# EAGLE schematic TL-WR703N (EAGLE 6.1)
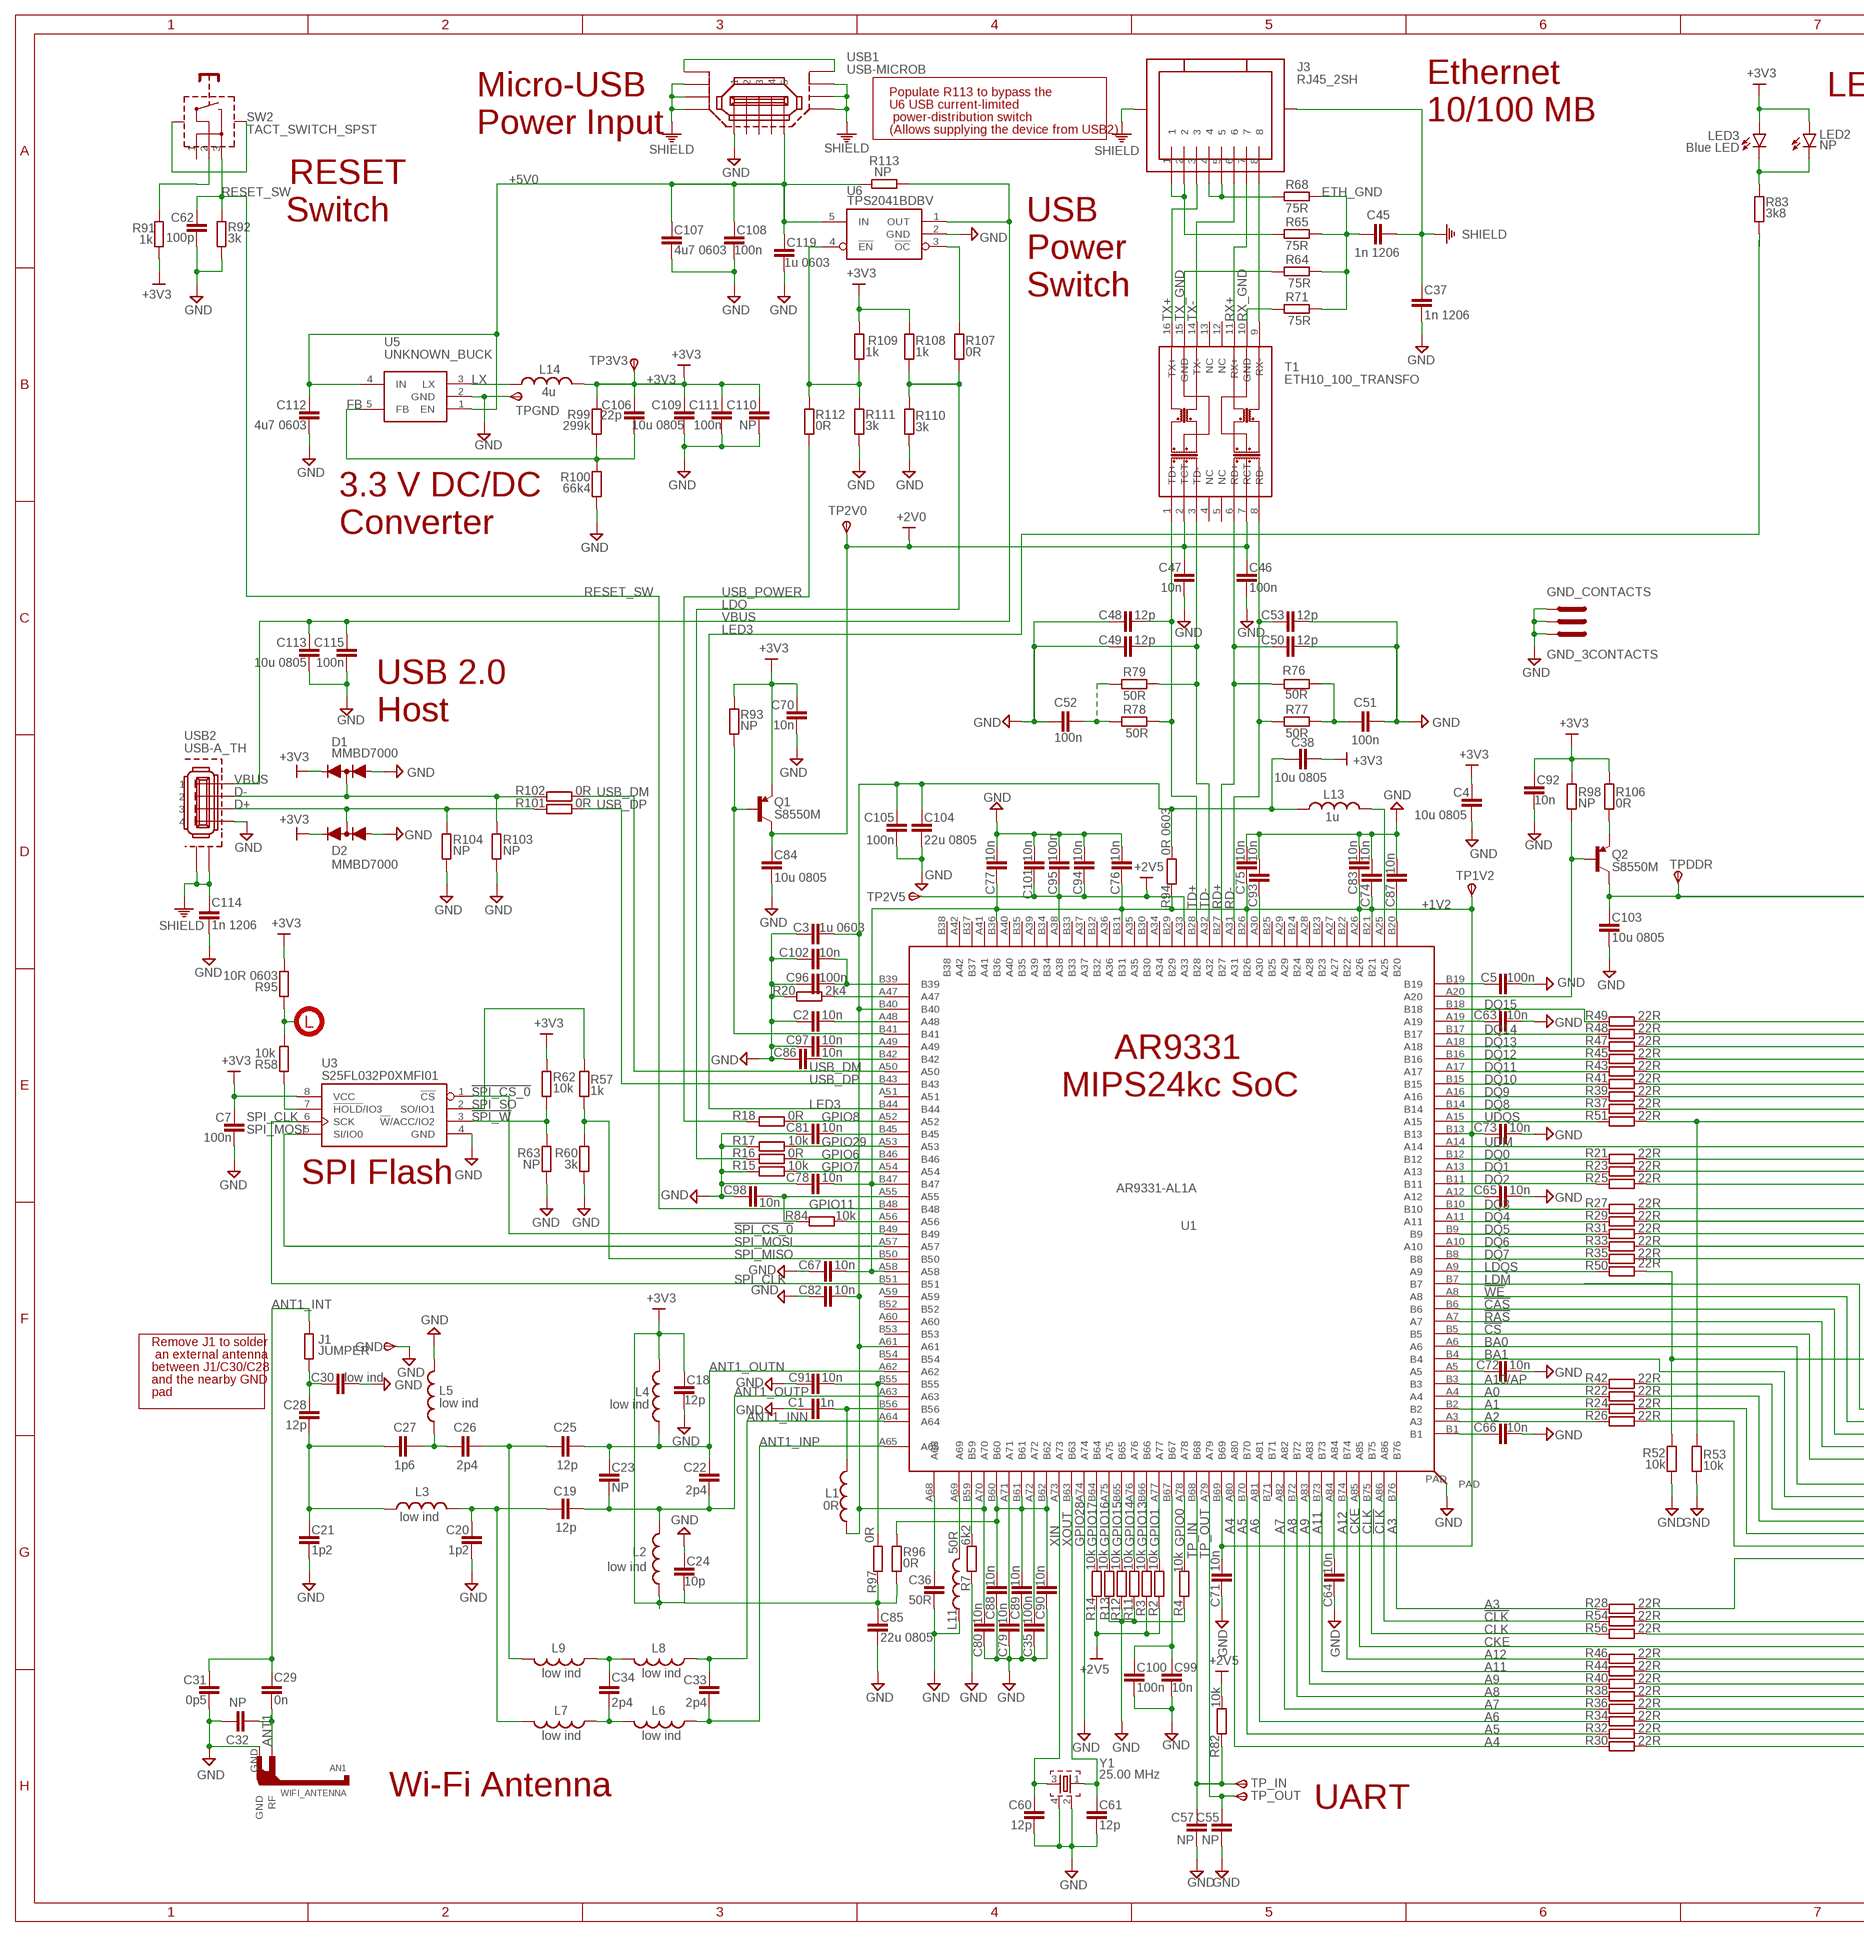
[diagram p0: schematic, sheet 1, part 1 of 2]
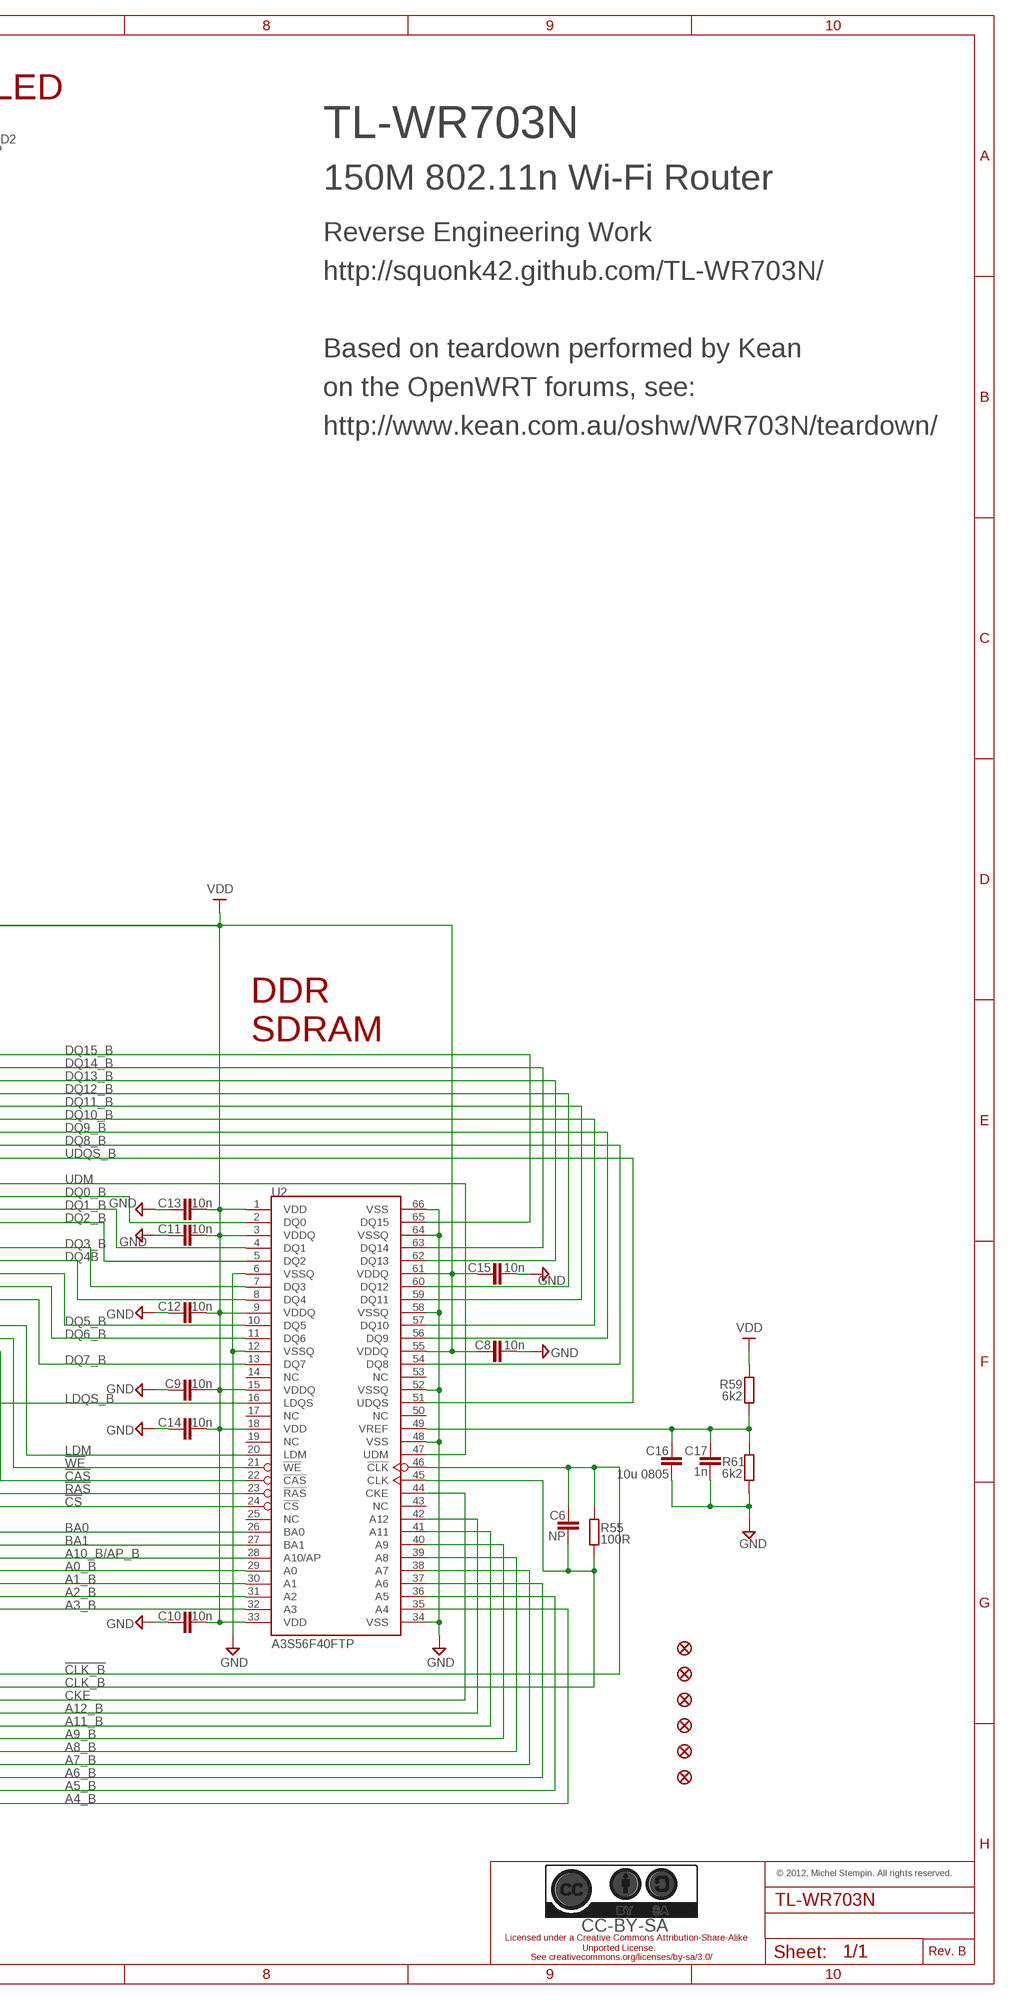
[diagram p1: schematic, sheet 1, part 2 of 2]

## Parts
AN1  WIFI_ANTENNA  [WIFI_ANTENNA]
C1  1n  CAP_0402  [C0402]
C2  10n  CAP_0402  [C0402]
C3  1u 0603  CAP_0603  [C0603]
C4  10u 0805  CAP_0805  [C0805]
C5  100n  CAP_0402  [C0402]
C6  NP  CAP_0402  [C0402]
C7  100n  CAP_0402  [C0402]
C8  10n  CAP_0402  [C0402]
C9  10n  CAP_0402  [C0402]
C10  10n  CAP_0402  [C0402]
C11  10n  CAP_0402  [C0402]
C12  10n  CAP_0402  [C0402]
C13  10n  CAP_0402  [C0402]
C14  10n  CAP_0402  [C0402]
C15  10n  CAP_0402  [C0402]
C16  10u 0805  CAP_0805  [C0805]
C17  1n  CAP_0402  [C0402]
C18  12p  CAP_0402  [C0402]
C19  12p  CAP_0402  [C0402]
C20  1p2  CAP_0402  [C0402]
C21  1p2  CAP_0402  [C0402]
C22  2p4  CAP_0402  [C0402]
C23  NP  CAP_0402  [C0402]
C24  10p  CAP_0402  [C0402]
C25  12p  CAP_0402  [C0402]
C26  2p4  CAP_0402  [C0402]
C27  1p6  CAP_0402  [C0402]
C28  12p  CAP_0402  [C0402]
C29  0n  CAP_0402  [C0402]
C30  low ind  CAP_0402  [C0402]
C31  0p5  CAP_0402  [C0402]
C32  NP  CAP_0402  [C0402]
C33  2p4  CAP_0402  [C0402]
C34  2p4  CAP_0402  [C0402]
C35  100n  CAP_0402  [C0402]
C36  50R  CAP_0402  [C0402]
C37  1n 1206  CAP_1206  [C1206]
C38  10u 0805  CAP_0805  [C0805]
C45  1n 1206  CAP_1206  [C1206]
C46  100n  CAP_0402  [C0402]
C47  10n  CAP_0402  [C0402]
C48  12p  CAP_0402  [C0402]
C49  12p  CAP_0402  [C0402]
C50  12p  CAP_0402  [C0402]
C51  100n  CAP_0402  [C0402]
C52  100n  CAP_0402  [C0402]
C53  12p  CAP_0402  [C0402]
C55  NP  CAP_0402  [C0402]
C57  NP  CAP_0402  [C0402]
C60  12p  CAP_0402  [C0402]
C61  12p  CAP_0402  [C0402]
C62  100p  CAP_0402  [C0402]
C63  10n  CAP_0402  [C0402]
C64  10n  CAP_0402  [C0402]
C65  10n  CAP_0402  [C0402]
C66  10n  CAP_0402  [C0402]
C67  10n  CAP_0402  [C0402]
C70  10n  CAP_0402  [C0402]
C71  10n  CAP_0402  [C0402]
C72  10n  CAP_0402  [C0402]
C73  10n  CAP_0402  [C0402]
C74  10n  CAP_0402  [C0402]
C75  10n  CAP_0402  [C0402]
C76  10n  CAP_0402  [C0402]
C77  10n  CAP_0402  [C0402]
C78  10n  CAP_0402  [C0402]
C79  10n  CAP_0402  [C0402]
C80  10n  CAP_0402  [C0402]
C81  10n  CAP_0402  [C0402]
C82  10n  CAP_0402  [C0402]
C83  10n  CAP_0402  [C0402]
C84  10u 0805  CAP_0805  [C0805]
C85  22u 0805  CAP_0805  [C0805]
C86  10n  CAP_0402  [C0402]
C87  10n  CAP_0402  [C0402]
C88  10n  CAP_0402  [C0402]
C89  10n  CAP_0402  [C0402]
C90  10n  CAP_0402  [C0402]
C91  10n  CAP_0402  [C0402]
C92  10n  CAP_0402  [C0402]
C93  10n  CAP_0402  [C0402]
C94  10n  CAP_0402  [C0402]
C95  100n  CAP_0402  [C0402]
C96  100n  CAP_0402  [C0402]
C97  10n  CAP_0402  [C0402]
C98  10n  CAP_0402  [C0402]
C99  10n  CAP_0402  [C0402]
C100  100n  CAP_0402  [C0402]
C101  10n  CAP_0402  [C0402]
C102  10n  CAP_0402  [C0402]
C103  10u 0805  CAP_0805  [C0805]
C104  22u 0805  CAP_0805  [C0805]
C105  100n  CAP_0402  [C0402]
C106  22p  CAP_0402  [C0402]
C107  4u7 0603  CAP_0603  [C0603]
C108  100n  CAP_0402  [C0402]
C109  10u 0805  CAP_0805  [C0805]
C110  NP  CAP_0603  [C0603]
C111  100n  CAP_0402  [C0402]
C112  4u7 0603  CAP_0603  [C0603]
C113  10u 0805  CAP_0805  [C0805]
C114  1n 1206  CAP_1206  [C1206]
C115  100n  CAP_0402  [C0402]
C119  1u 0603  CAP_0603  [C0603]
D1  MMBD7000  [SOT23-3]
D2  MMBD7000  [SOT23-3]
E$1  FIDUCIAL  [FIDUCIAL]
E$2  FIDUCIAL  [FIDUCIAL]
E$3  FIDUCIAL  [FIDUCIAL]
E$4  FIDUCIAL  [FIDUCIAL]
E$5  FIDUCIAL  [FIDUCIAL]
E$6  FIDUCIAL  [FIDUCIAL]
E$7  CC-BY-SA  [CC-BY-SA]
GND  TEST_PAD_SHIELD  [SHIELD_PAD]
GND_CONTACTS  GND_3CONTACTS  [GND_3CONTACT]
J1  JUMPER  [J0603]
J3  RJ45_2SH  [RJ45_LP_RA_SMT]
L1  0R  IND_0402  [L0402]
L2  low ind  IND_0402  [L0402]
L3  low ind  IND_0402  [L0402]
L4  low ind  IND_0402  [L0402]
L5  low ind  IND_0402  [L0402]
L6  low ind  IND_0402  [L0402]
L7  low ind  IND_0402  [L0402]
L8  low ind  IND_0402  [L0402]
L9  low ind  IND_0402  [L0402]
L11  50R  IND_0402  [L0402]
L13  1u  IND_1008  [L1008]
L14  4u  IND_SELF  [FERRITE_SELF]
LED2  NP  LED_3MM  [LED3MM]
LED3  Blue LED  LED_0603  [LED0603]
Q1  S8550M  TRANSISTOR_PNP  [SOT23-3]
Q2  S8550M  TRANSISTOR_PNP  [SOT23-3]
R2  10k  RES_0402  [R0402]
R3  10k  RES_0402  [R0402]
R4  10k  RES_0402  [R0402]
R7  6k2  RES_0402  [R0402]
R11  10k  RES_0402  [R0402]
R12  10k  RES_0402  [R0402]
R13  10k  RES_0402  [R0402]
R14  10k  RES_0402  [R0402]
R15  10k  RES_0402  [R0402]
R16  0R  RES_0402  [R0402]
R17  10k  RES_0402  [R0402]
R18  0R  RES_0402  [R0402]
R20  2k4  RES_0402  [R0402]
R21  22R  RES_0402  [R0402]
R22  22R  RES_0402  [R0402]
R23  22R  RES_0402  [R0402]
R24  22R  RES_0402  [R0402]
R25  22R  RES_0402  [R0402]
R26  22R  RES_0402  [R0402]
R27  22R  RES_0402  [R0402]
R28  22R  RES_0402  [R0402]
R29  22R  RES_0402  [R0402]
R30  22R  RES_0402  [R0402]
R31  22R  RES_0402  [R0402]
R32  22R  RES_0402  [R0402]
R33  22R  RES_0402  [R0402]
R34  22R  RES_0402  [R0402]
R35  22R  RES_0402  [R0402]
R36  22R  RES_0402  [R0402]
R37  22R  RES_0402  [R0402]
R38  22R  RES_0402  [R0402]
R39  22R  RES_0402  [R0402]
R40  22R  RES_0402  [R0402]
R41  22R  RES_0402  [R0402]
R42  22R  RES_0402  [R0402]
R43  22R  RES_0402  [R0402]
R44  22R  RES_0402  [R0402]
R45  22R  RES_0402  [R0402]
R46  22R  RES_0402  [R0402]
R47  22R  RES_0402  [R0402]
R48  22R  RES_0402  [R0402]
R49  22R  RES_0402  [R0402]
R50  22R  RES_0402  [R0402]
R51  22R  RES_0402  [R0402]
R52  10k  RES_0402  [R0402]
R53  10k  RES_0402  [R0402]
R54  22R  RES_0402  [R0402]
R55  100R  RES_0402  [R0402]
R56  22R  RES_0402  [R0402]
R57  1k  RES_0402  [R0402]
R58  10k  RES_0402  [R0402]
R59  6k2  RES_0402  [R0402]
R60  3k  RES_0402  [R0402]
R61  6k2  RES_0402  [R0402]
R62  10k  RES_0402  [R0402]
R63  NP  RES_0402  [R0402]
R64  75R  RES_0402  [R0402]
R65  75R  RES_0402  [R0402]
R68  75R  RES_0402  [R0402]
R71  75R  RES_0402  [R0402]
R76  50R  RES_0402  [R0402]
R77  50R  RES_0402  [R0402]
R78  50R  RES_0402  [R0402]
R79  50R  RES_0402  [R0402]
R82  10k  RES_0402  [R0402]
R83  3k8  RES_0402  [R0402]
R84  10k  RES_0402  [R0402]
R91  1k  RES_0402  [R0402]
R92  3k  RES_0402  [R0402]
R93  NP  RES_0402  [R0402]
R94  0R 0603  RES_0603  [R0603]
R95  10R 0603  RES_0603  [R0603]
R96  0R  RES_0402  [R0402]
R97  0R  RES_0402  [R0402]
R98  NP  RES_0402  [R0402]
R99  299k  RES_0402  [R0402]
R100  66k4  RES_0402  [R0402]
R101  0R  RES_0402  [R0402]
R102  0R  RES_0402  [R0402]
R103  NP  RES_0402  [R0402]
R104  NP  RES_0402  [R0402]
R106  0R  RES_0402  [R0402]
R107  0R  RES_0402  [R0402]
R108  1k  RES_0402  [R0402]
R109  1k  RES_0402  [R0402]
R110  3k  RES_0402  [R0402]
R111  3k  RES_0402  [R0402]
R112  0R  RES_0402  [R0402]
R113  NP  RES_0805  [R0805]
SW2  TACT_SWITCH_SPST  [TACT_SWITCH_SPST_RA_SMT]
T1  ETH10_100_TRANSFO  [H1601CG]
TP1V2  TEST_PAD  [TEST_PAD]
TP2V0  TEST_PAD  [TEST_PAD]
TP2V5  TEST_PAD  [TEST_PAD]
TP3V3  TEST_PAD  [TEST_PAD]
TP_IN  TEST_PAD  [TEST_PAD]
TP_OUT  TEST_PAD  [TEST_PAD]
TPDDR  TEST_PAD  [TEST_PAD]
TPGND  TEST_PAD  [TEST_PAD]
U1  AR9331-AL1A  [DRMLF164]
U2  A3S56F40FTP  [TSOP66]
U3  S25FL032P0XMFI01  [SOP8]
U5  UNKNOWN_BUCK  [SOT23-5]
U6  TPS2041BDBV  [SOT23-5]
USB1  USB-MICROB  [USB-MICROB]
USB2  USB-A_TH  [USB-A_TH]
Y1  25.00 MHz  CRYSTAL_2SHIELD  [CRYSTAL_32_25]

## Nets
!CAS: U1.B6 U2.22(!CAS)
!CLK: R54.1 U1.A86
!CLK_B: C6.2 R54.2 R55.2 U2.46(!CLK)
!CS: U1.B5 U2.24(!CS)
!RAS: U1.A7 U2.23(!RAS)
!SPI_CS_0: U1.B49 U3.1(!CS)
!SPI_W: R62.2 R63.1 U3.3(!W!/ACC/IO2)
!WE: U1.A8 U2.21(!WE)
$28: C52.2 R78.1 R79.2
+1V2 [Power]: C67.2 C71.2 C73.1 C74.2 C75.1 C76.1 C77.2 C78.2 C83.1 R94.2 TP1V2.1(PP) U1.A26 U1.A58 U1.B13 U1.B21 U1.B26 U1.B31 U1.B36 U1.B47 U1.B69
+2V0 [Power]: C46.1 C47.1 C84.2 Q1.3(C) T1.2(TCT) T1.7(RCT) TP2V0.1(PP)
+2V5 [Power]: C94.2 C95.2 C101.2 R2.1 R3.1 R14.2 R82.1 TP2V5.1(PP) U1.A33 U1.A38
+3V3: C4.2 C7.1 C18.1 C24.1 C38.2 C70.2 C85.2 C92.2 C106.2 C109.2 C110.1 C111.1 D1.2(C) D2.2(C) L2.1 L4.2 L14.1 LED2.A LED3.A Q1.2(E) R62.1 R91.1 R93.2 R95.1 R96.2 R97.2 R98.2 R99.2 R106.2 R108.2 R109.1 TP3V3.1(PP) U3.8(VCC)
+5V0 [Power]: C107.2 C108.2 C112.1 C119.1 R113.1 U5.1(EN) U5.4(IN) U6.5(IN) USB1.VBUS
A0: R22.1 U1.A4
A0_B: R22.2 U2.29(A0)
A1: R24.1 U1.B2
A1_B: R24.2 U2.30(A1)
A2: R26.1 U1.A3
A2_B: R26.2 U2.31(A2)
A3: R28.1 U1.B76
A3_B: R28.2 U2.32(A3)
A4: R30.1 U1.A80
A4_B: R30.2 U2.35(A4)
A5: R32.1 U1.B70
A5_B: R32.2 U2.36(A5)
A6: R34.1 U1.A81
A6_B: R34.2 U2.37(A6)
A7: R36.1 U1.A82
A7_B: R36.2 U2.38(A7)
A8: R38.1 U1.B72
A8_B: R38.2 U2.39(A8)
A9: R40.1 U1.A83
A9_B: R40.2 U2.40(A9)
A10/AP: R42.1 U1.B3
A10_B/AP_B: R42.2 U2.28(A10/AP)
A11: R44.1 U1.B73
A11_B: R44.2 U2.41(A11)
A12: R46.1 U1.B74
A12_B: R46.2 U2.42(A12)
ANT1 [RF]: AN1.RF C29.2 C32.2
ANT1_INN [RF]: C33.2 L8.1 U1.A64
ANT1_INP [RF]: C33.1 L6.1 U1.A65
ANT1_INT [RF]: C29.1 C31.1 J1.2
ANT1_OUTN [RF]: C22.2 C23.2 C25.2 L4.1 U1.A62
ANT1_OUTP [RF]: C19.2 C22.1 C23.1 L2.2 U1.A63
BA0: U1.A6 U2.26(BA0)
BA1: U1.B4 U2.27(BA1)
CKE: U1.A85 U2.44(CKE)
CLK: R56.1 U1.B75
CLK_B: C6.1 R55.1 R56.2 U2.45(CLK)
D+: D2.3(M) R101.1 R104.1 USB2.3
D-: D1.3(M) R102.1 R103.1 USB2.2
DQ0: R21.2 U1.B12
DQ0_B: R21.1 U2.2(DQ0)
DQ1: R23.2 U1.A13
DQ1_B: R23.1 U2.4(DQ1)
DQ2: R25.2 U1.B11
DQ2_B: R25.1 U2.5(DQ2)
DQ3: R27.2 U1.B10
DQ3_B: R27.1 U2.7(DQ3)
DQ4: R29.2 U1.A11
DQ4B: R29.1 U2.8(DQ4)
DQ5: R31.2 U1.B9
DQ5_B: R31.1 U2.10(DQ5)
DQ6: R33.2 U1.A10
DQ6_B: R33.1 U2.11(DQ6)
DQ7: R35.2 U1.B8
DQ7_B: R35.1 U2.13(DQ7)
DQ8: R37.1 U1.B14
DQ8_B: R37.2 U2.54(DQ8)
DQ9: R39.1 U1.A16
DQ9_B: R39.2 U2.56(DQ9)
DQ10: R41.1 U1.B15
DQ10_B: R41.2 U2.57(DQ10)
DQ11: R43.1 U1.A17
DQ11_B: R43.2 U2.59(DQ11)
DQ12: R45.1 U1.B16
DQ12_B: R45.2 U2.60(DQ12)
DQ13: R47.1 U1.A18
DQ13_B: R47.2 U2.62(DQ13)
DQ14: R48.1 U1.B17
DQ14_B: R48.2 U2.63(DQ14)
DQ15: R49.1 U1.B18
DQ15_B: R49.2 U2.65(DQ15)
ETH_GND [RF]: C45.2 R64.1 R65.2 R68.2 R71.1
FB: C106.1 R99.1 R100.2 U5.5(FB)
GND: AN1.GND C1.2 C2.2 C3.2 C4.1 C5.2 C7.2 C8.2 C9.1 C10.1 C11.1 C12.1 C13.1 C14.1 C15.2 C16.1 C17.1 C18.2 C20.1 C21.1 C24.2 C30.2 C31.2 C32.1 C35.1 C36.1 C37.1 C46.2 C47.2 C48.1 C49.2 C50.1 C51.1 C52.1 C53.2 C55.2 C57.1 C60.1 C61.2 C62.1 C63.1 C64.1 C65.2 C66.1 C67.1 C70.1 C71.1 C72.1 C73.2 C74.1 C75.2 C76.2 C77.1 C78.1 C79.2 C80.2 C81.1 C82.1 C83.2 C84.1 C85.1 C86.1 C87.2 C88.2 C89.2 C90.2 C91.1 C92.1 C93.1 C94.1 C95.1 C96.1 C97.2 C98.2 C99.1 C100.1 C101.1 C102.1 C103.2 C104.2 C105.2 C107.1 C108.1 C109.1 C110.2 C111.2 C112.2 C113.1 C114.2 C115.1 C119.2 D1.1(A) D2.1(A) GND.1(PP) GND_CONTACTS.GND$1(GND) GND_CONTACTS.GND$2(GND) GND_CONTACTS.GND$3(GND) L5.2 L11.1 R4.2 R7.2 R11.1 R12.1 R13.2 R15.1 R17.1 R20.2 R52.2 R53.1 R60.1 R61.2 R63.2 R92.1 R100.1 R103.2 R104.2 R110.2 R111.1 TPGND.1(PP) U1.A74 U1.PAD U2.6(VSSQ) U2.12(VSSQ) U2.34(VSS) U2.48(VSS) U2.52(VSSQ) U2.58(VSSQ) U2.64(VSSQ) U2.66(VSS) U3.4(GND) U5.2(GND) U6.2(GND) USB1.GND USB2.4 Y1.2 Y1.4
GPIO0: R4.1 U1.A78
GPIO1: R2.2 U1.A77
GPIO6: R16.2 U1.B46
GPIO7: R15.2 U1.A54
GPIO8: R18.2 U1.A52
GPIO11: C62.2 R92.2 SW2.3 U1.B48
GPIO13 [Power]: R3.2 U1.B66
GPIO14: R11.2 U1.A76
GPIO15: R12.2 U1.B65
GPIO16: R13.1 U1.A75
GPIO17: R14.1 U1.B64
GPIO29: R17.2 U1.A53
LDM: U1.B7 U2.20(LDM)
LDO: R16.1 R107.1 R108.1 R110.1
LDQS: R50.2 U1.A9
LDQS_B: R50.1 R52.1 U2.16(LDQS)
LED3: R83.1 U1.B44
LX: L14.2 U5.3(LX)
N$1: C79.1 U1.A71
RD+: C50.2 R76.2 T1.6(RD+) U1.B27
RD-: C53.1 R77.1 T1.8(RD-) U1.A31
RX+: J3.7 T1.11(RX+)
RX-: J3.8 T1.9(RX-)
RX_GND: R71.2 T1.10(GND)
S$15: C99.2 C100.2 U1.B67
S$17 [RF]: C19.1 C20.2 L3.2 L7.2
S$18: C3.1 C38.1 C80.1 C82.2 C104.1 C105.1 L1.2 L13.1 R94.1 U1.A61 U1.A70 U1.B40
S$36: C65.1 U1.A12
S$44: C16.2 C17.2 R59.2 R61.1 U2.49(VREF)
S$54: C51.2 R76.1 R77.2
S$55: LED2.K(C) LED3.C R83.2
S$73 [RF]: C34.1 L6.2 L7.1
S$76: C1.1 L1.1 U1.B56
S$78: R58.1 R95.2
S$80 [RF]: C21.2 C27.1 C28.1 L3.1
S$87 [RF]: C28.2 C30.1 J1.1
S$94 [RF]: C26.1 C27.2 L5.1
S$95: R20.1 U1.A47
S$102: C86.2 U1.B42
S$103: C5.1 C87.1 U1.B19 U1.B20
S$106: R91.2 SW2.2
S$107: SW2.S$1(SH$1) SW2.S$2(SH$2)
S$110 [RF]: USB1.P$1(M0) USB1.P$2(M7)
S$114: C35.2 U1.A72
S$115: L11.2 U1.A69
S$116: R7.1 U1.B59
S$117: C88.1 C89.1 C90.1 R96.1 U1.B60 U1.B61 U1.B62
S$121: C63.2 U1.A19
S$122: C81.2 U1.B45
S$125: C91.2 R97.1 U1.B55
S$127 [RF]: C34.2 L8.2 L9.1
S$128: R109.2 R111.2 R112.2 U6.4(!EN)
S$130 [RF]: C25.1 C26.2 L9.2
S$133 [Power]: C96.2 C102.2 U1.B39
S$135: C97.1 U1.A49
S$136: C98.1 R84.1 U1.A55
S$137: R58.2 U3.7(!HOLD!/IO3)
S$138: R84.2 U1.A56
S$145: L13.2 U1.A25
S$152: C2.1 U1.A48
S$192 [Power]: C64.2 C66.2 U1.A84 U1.B1
S$194: R107.2 U6.3(!OC)
S$203 [Power]: Q1.1(B) R93.1 U1.B41
S$290: J3.1 J3.2 R65.1
S$291: J3.4 J3.5 R68.1
S$354 [Power]: C36.2 U1.A68
S$380 [Power]: Q2.2(E) R106.1
S$409: C93.2 U1.A30
S$430 [Power]: Q2.1(B) R98.1 U1.A20
S$434 [Power]: C72.2 U1.A5
SHIELD [RF]: C37.2 C45.1 C114.1 J3.S$1(SHIELD) J3.S$2(SHIELD) USB1.S$1(M1) USB1.S$2(M2) USB1.S$3(M3) USB1.S$4(M4) USB1.S$5(M5) USB1.S$6(M6) USB2.S$1(M1) USB2.S$2(M2)
SPI_CLK: U1.B51 U3.6(SCK)
SPI_MISO: R57.2 R60.2 U1.B50
SPI_MOSI: U1.A57 U3.5(SI/IO0)
SPI_SO: R57.1 U3.2(SO/IO1)
TD+: C48.2 R78.2 T1.1(TD+) U1.B28
TD-: C49.1 R79.1 T1.3(TD-) U1.A32
TP_IN: C57.2 R82.2 TP_IN.1(PP) U1.B68
TP_OUT: C55.1 TP_OUT.1(PP) U1.A79
TX+: J3.3 T1.16(TX+)
TX-: J3.6 T1.14(TX-)
TX_GND: R64.2 T1.15(GND)
UDM: U1.A14 U2.47(UDM)
UDQS: R51.1 U1.A15
UDQS_B: R51.2 R53.2 U2.51(UDQS)
USB_DM: R102.2 U1.A50
USB_DP: R101.2 U1.B43
USB_POWER [Power]: R18.1 R112.1
VBUS [Power]: C113.2 C115.2 R113.2 U6.1(OUT) USB2.1
VDD [Power]: C8.1 C9.2 C10.2 C11.2 C12.2 C13.2 C14.2 C15.1 C103.1 Q2.3(C) R59.1 TPDDR.1(PP) U2.1(VDD) U2.3(VDDQ) U2.9(VDDQ) U2.15(VDDQ) U2.18(VDD) U2.33(VDD) U2.55(VDDQ) U2.61(VDDQ)
XIN: C60.2 U1.A73 Y1.3
XOUT: C61.1 U1.B63 Y1.1
Unconnected: SW2.1 T1.4(NC) T1.5(NC) T1.12(NC) T1.13(NC) U1.A27 U1.A28 U1.A29 U1.A34 U1.A35 U1.A36 U1.A37 U1.A39 U1.A40 U1.A41 U1.A42 U1.A51 U1.A59 U1.A60 U1.B22 U1.B23 U1.B24 U1.B25 U1.B29 U1.B30 U1.B32 U1.B33 U1.B34 U1.B35 U1.B37 U1.B38 U1.B52 U1.B53 U1.B54 U1.B71 U2.14(NC) U2.17(NC) U2.19(NC) U2.25(NC) U2.43(NC) U2.50(NC) U2.53(NC) USB1.D+ USB1.D- USB1.ID

## Notes on the sheet
- Ethernet
- Micro-USB | Populate R113 to bypass the | LED
- U6 USB current-limited
- power-distribution switch | 10/100 MB
- Power Input | (Allows supplying the device from USB2) | TL-WR703N
- RESET | 150M 802.11n Wi-Fi Router
- RESET_SW
- Switch | USB
- Reverse Engineering Work
- Power
- http://squonk42.github.com/TL-WR703N/
- Switch
- Based on teardown performed by Kean
- on the OpenWRT forums, see:
- http://www.kean.com.au/oshw/WR703N/teardown/
- 3.3 V DC/DC
- Converter
- RESET_SW
- USB 2.0
- Host
- DDR
- SDRAM
- L
- AR9331
- MIPS24kc SoC
- SPI Flash
- Remove J1 to solder
- an external antenna
- between J1/C30/C28
- and the nearby GND
- pad
- GPIO28
- Wi-Fi Antenna
- UART
- © 2012, Michel Stempin. All rights reserved.
- CC-BY-SA
- Licensed under a Creative Commons Attribution-Share-Alike
- Unported License.
- Rev. B
- See creativecommons.org/licenses/by-sa/3.0/

## Library data of the parts
AN1 = TL-WR703N:WIFI_ANTENNA: Wifi PCB Antenna Copyright © 2012, Michel Stempin, All rights reserved Licenced under Creative Commons CC BY-SA 3.0 <http://creativecommons.org/licenses/by-sa/3.0/deed.en> license.
C1-C38 C45-C53 C55 C57 C60-C67 C70-C115 C119 = TL-WR703N:CAP_: Capacitor Copyright © 2012, Michel Stempin, All rights reserved Licenced under Creative Commons CC BY-SA 3.0 <http://creativecommons.org/licenses/by-sa/3.0/deed.en> license.
D1 D2 = TL-WR703N:MMBD7000: Dual Small Signal Switching Diode in Series Based on: MMBD7000 Datasheet <http://www.taitroncomponents.com/catalog/Datasheet/MMBD7000.pdf> Copyright © 2012, Michel Stempin, All rights reserved Licenced under Creative Commons CC BY-SA 3.0 <http://creativecommons.org/licenses/by-sa/3.0/deed.en> license.
E$1-E$6 = TL-WR703N:FIDUCIAL: Fiducial Mark Copyright © 2012, Michel Stempin, All rights reserved Licenced under Creative Commons CC BY-SA 3.0 <http://creativecommons.org/licenses/by-sa/3.0/deed.en> license.
E$7 = TL-WR703N:CC-BY-SA: Attribution-Share-Alike Unported License See creativecommons.org/licenses/by-sa/3.0/ for details.
GND TP1V2 TP2V0 TP2V5 TP3V3 TP_IN TP_OUT TPDDR TPGND = TL-WR703N:TEST_PAD: Test Pad Copyright © 2012, Michel Stempin, All rights reserved Licenced under Creative Commons CC BY-SA 3.0 <http://creativecommons.org/licenses/by-sa/3.0/deed.en> license.
GND_CONTACTS = TL-WR703N:GND_3CONTACTS: Ground Contacts x3 Copyright © 2012, Michel Stempin, All rights reserved Licenced under Creative Commons CC BY-SA 3.0 <http://creativecommons.org/licenses/by-sa/3.0/deed.en> license.
J1 = TL-WR703N:JUMPER: Jumper Copyright © 2012, Michel Stempin, All rights reserved Licenced under Creative Commons CC BY-SA 3.0 <http://creativecommons.org/licenses/by-sa/3.0/deed.en> license.
J3 = TL-WR703N:RJ45_2SH: RJ45 Socket with 2 Shield Pins Copyright © 2012, Michel Stempin, All rights reserved Licenced under Creative Commons CC BY-SA 3.0 <http://creativecommons.org/licenses/by-sa/3.0/deed.en> license.
L1-L9 L11 L13 L14 = TL-WR703N:IND_: Inductor Copyright © 2012, Michel Stempin, All rights reserved Licenced under Creative Commons CC BY-SA 3.0 <http://creativecommons.org/licenses/by-sa/3.0/deed.en> license.
LED2 LED3 = TL-WR703N:LED_: LED Copyright © 2012, Michel Stempin, All rights reserved Licenced under Creative Commons CC BY-SA 3.0 <http://creativecommons.org/licenses/by-sa/3.0/deed.en> license.
Q1 Q2 = TL-WR703N:TRANSISTOR_PNP: PNP Transistor Copyright © 2012, Michel Stempin, All rights reserved Licenced under Creative Commons CC BY-SA 3.0 <http://creativecommons.org/licenses/by-sa/3.0/deed.en> license.
R2-R4 R7 R11-R18 R20-R65 R68 R71 R76-R79 R82-R84 R91-R104 R106-R113 = TL-WR703N:RES_: Resistor Copyright © 2012, Michel Stempin, All rights reserved Licenced under Creative Commons CC BY-SA 3.0 <http://creativecommons.org/licenses/by-sa/3.0/deed.en> license.
SW2 = TL-WR703N:TACT_SWITCH_SPST: Tact Switch SPST with 2 Contacts and 2 Shield Pins Copyright © 2012, Michel Stempin, All rights reserved Licenced under Creative Commons CC BY-SA 3.0 <http://creativecommons.org/licenses/by-sa/3.0/deed.en> license.
T1 = TL-WR703N:ETH10_100_TRANSFO: 10/100Base Single Port Transformer Based on: H1601CG Datasheet <http://www.cptc.com.tw/product/doc/Single%20Port/H1601CG.pdf> Copyright © 2012, Michel Stempin, All rights reserved Licenced under Creative Commons CC BY-SA 3.0 <http://creativecommons.org/licenses/by-sa/3.0/deed.en> license.
U1 = TL-WR703N:AR9331-: Atheros AR9331 SoC Copyright © 2012, Michel Stempin, All rights reserved Licenced under Creative Commons CC BY-SA 3.0 <http://creativecommons.org/licenses/by-sa/3.0/deed.en> license.
U2 = TL-WR703N:A3S56: 256Mb DDR SDRAM Copyright © 2012, Michel Stempin, All rights reserved Licenced under Creative Commons CC BY-SA 3.0 <http://creativecommons.org/licenses/by-sa/3.0/deed.en> license.; WIDTH: 16-bit
U3 = TL-WR703N:S25FL: 32-Mbit CMOS 3.0 Volt Flash Memory with 104-MHz SPI (Serial Peripheral Interface) Multi I/O Bus Based on: S25FL032P Datasheet <http://www.spansion.com/Support/Datasheets/S25FL032P_00.pdf> Copyright © 2012, Michel Stempin, All rights reserved Licenced under Creative Commons CC BY-SA 3.0 <http://creativecommons.org/licenses/by-sa/3.0/deed.en> license.; DENSITY: 32 Mbit
U5 = TL-WR703N:UNKNOWN_BUCK: Unknown Buck Switching DC/DC Converter with Built-In Schottky Diode Copyright © 2012, Michel Stempin, All rights reserved Licenced under Creative Commons CC BY-SA 3.0 <http://creativecommons.org/licenses/by-sa/3.0/deed.en> license.
U6 = TL-WR703N:TPS2041B: Single USB Power Distribution Switch in 5-Pin Package Based on: TPS2051B Datasheet <http://www.ti.com/lit/ds/symlink/tps2051b.pdf> Copyright © 2012, Michel Stempin, All rights reserved Licenced under Creative Commons CC BY-SA 3.0 <http://creativecommons.org/licenses/by-sa/3.0/deed.en> license.
USB1 = TL-WR703N:USB-MICROB: Micro-USB B Socket, 6 Shield Pins Copyright © 2012, Michel Stempin, All rights reserved Licenced under Creative Commons CC BY-SA 3.0 <http://creativecommons.org/licenses/by-sa/3.0/deed.en> license.
USB2 = TL-WR703N:USB-A_TH: USB A Through-Hole Socket Copyright © 2012, Michel Stempin, All rights reserved Licenced under Creative Commons CC BY-SA 3.0 <http://creativecommons.org/licenses/by-sa/3.0/deed.en> license.
Y1 = TL-WR703N:CRYSTAL_2SHIELD: Crystal with 2 Shield Pins Copyright © 2012, Michel Stempin, All rights reserved Licenced under Creative Commons CC BY-SA 3.0 <http://creativecommons.org/licenses/by-sa/3.0/deed.en> license.

## Net classes
1 RF: clearance 0.508 mm
2 Power: clearance 0.305 mm